# Altium schematic sheet PulseBeeper.SchDoc
size A3
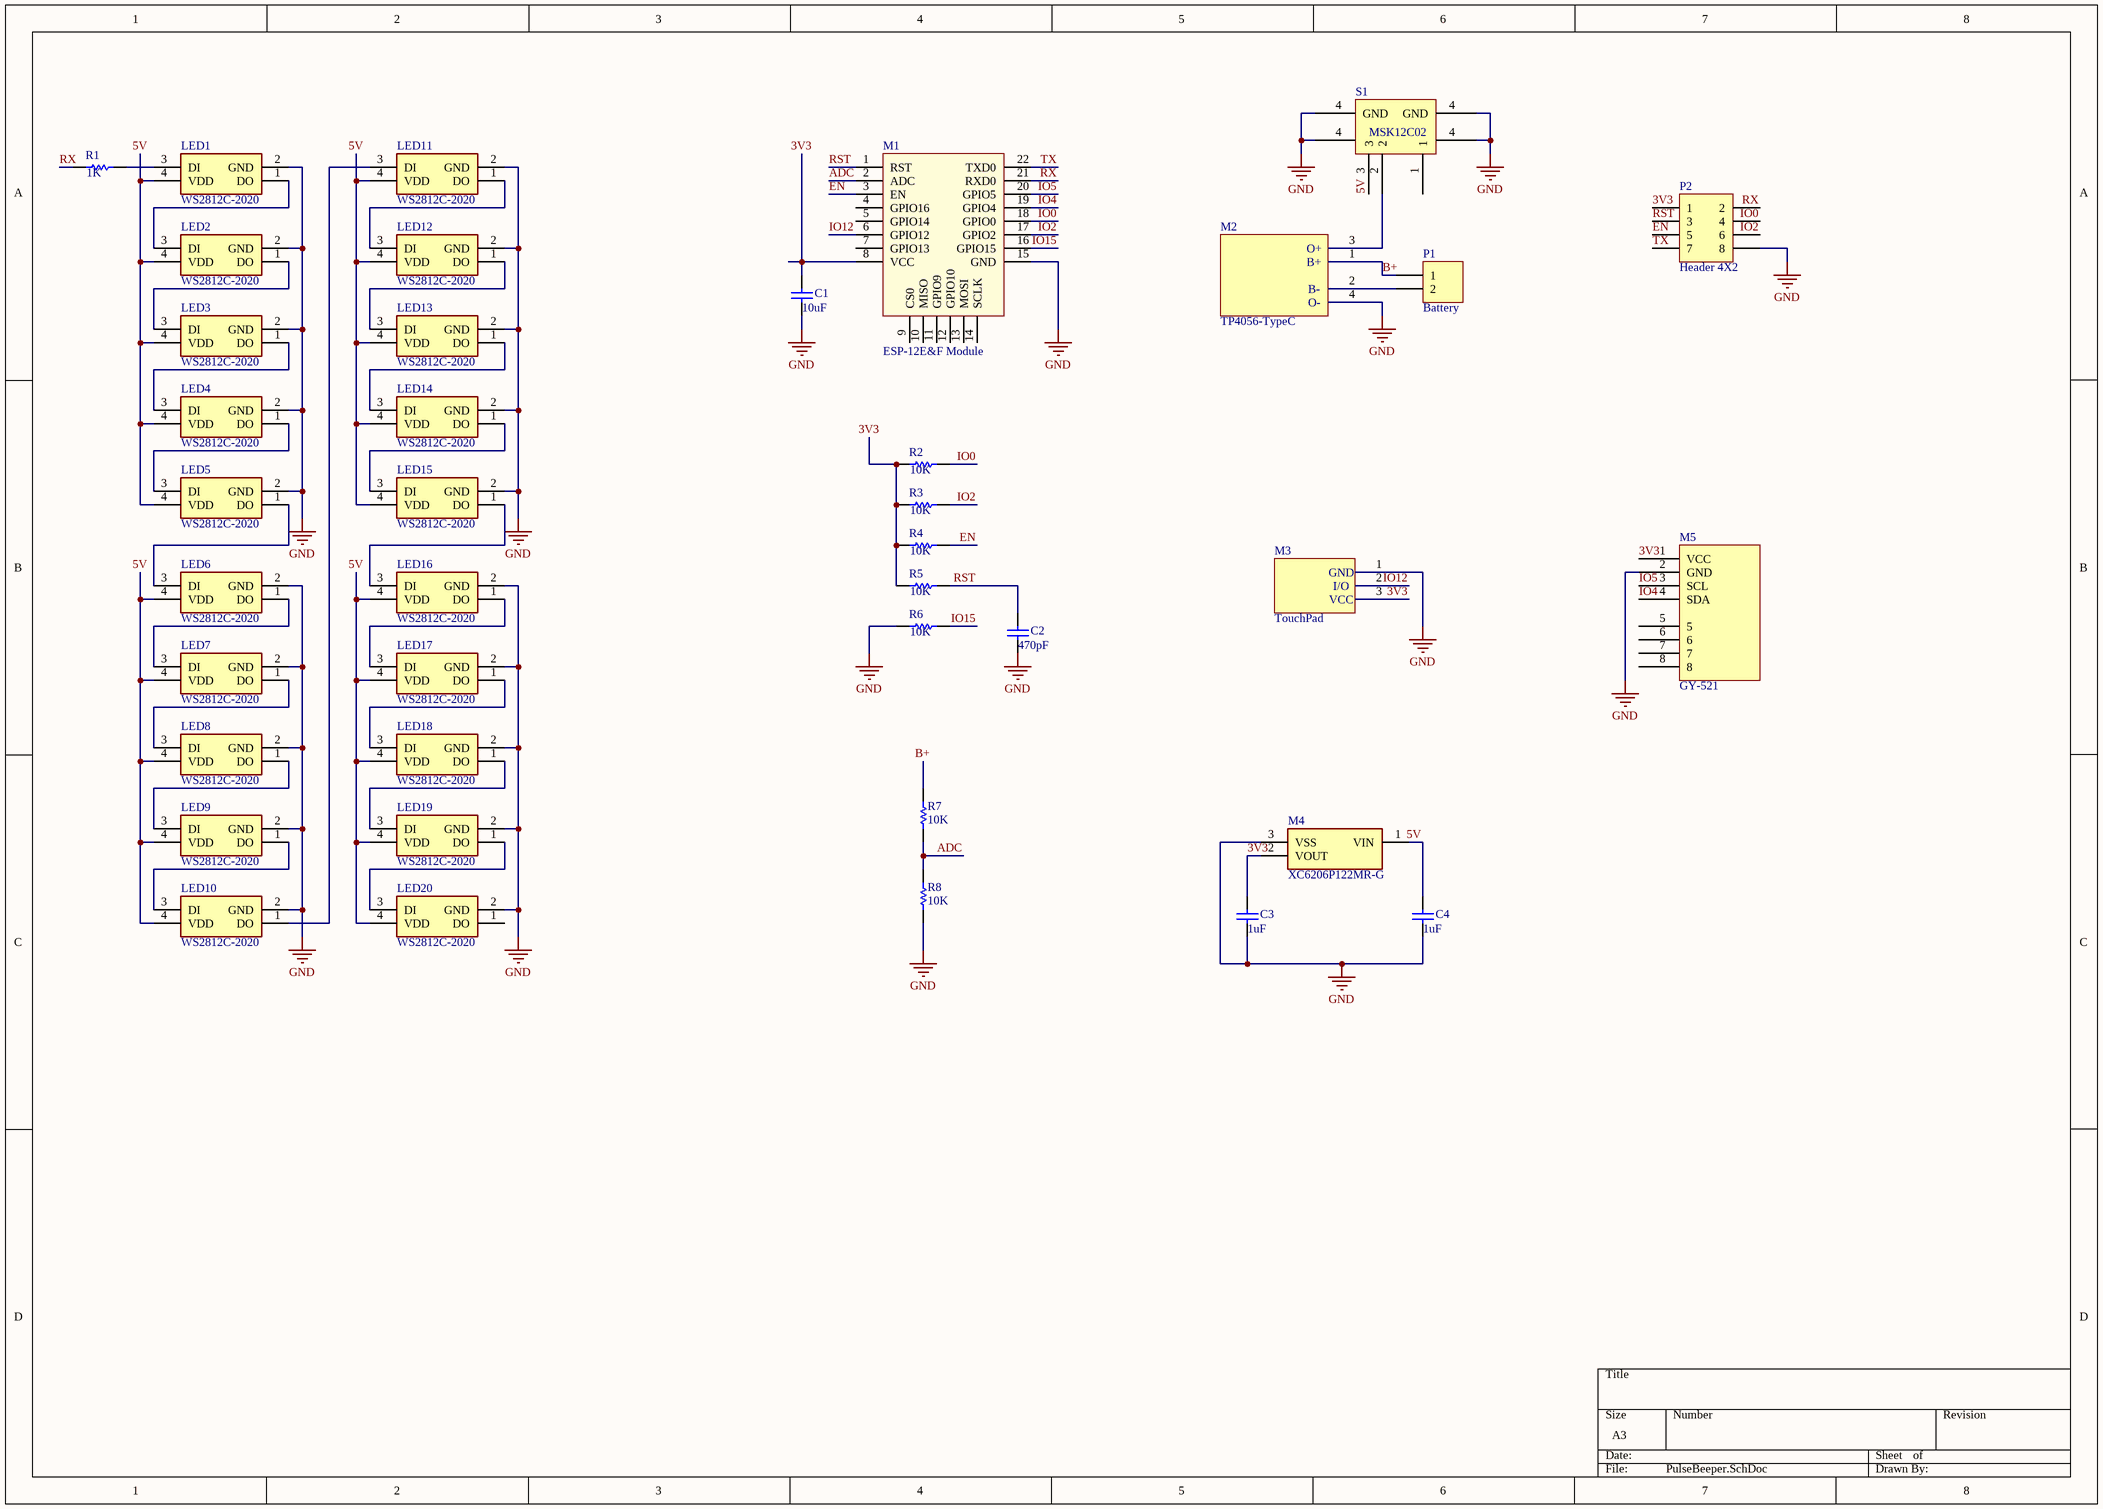
[diagram p0: PulseBeeper.SchDoc]

## Parts
C1  value 10uF  [6-0805_N]  (hidden comment: Cap)
C2  value 470pF  [6-0805_N]  (hidden comment: Cap)
C3  value 1uF  [6-0805_N]  (hidden comment: Cap)
C4  value 1uF  [6-0805_N]  (hidden comment: Cap)
LED1  WS2812C-2020  [WS2812 3535]
LED2  WS2812C-2020  [WS2812 3535]
LED3  WS2812C-2020  [WS2812 3535]
LED4  WS2812C-2020  [WS2812 3535]
LED5  WS2812C-2020  [WS2812 3535]
LED6  WS2812C-2020  [WS2812 3535]
LED7  WS2812C-2020  [WS2812 3535]
LED8  WS2812C-2020  [WS2812 3535]
LED9  WS2812C-2020  [WS2812 3535]
LED10  WS2812C-2020  [WS2812 3535]
LED11  WS2812C-2020  [WS2812 3535]
LED12  WS2812C-2020  [WS2812 3535]
LED13  WS2812C-2020  [WS2812 3535]
LED14  WS2812C-2020  [WS2812 3535]
LED15  WS2812C-2020  [WS2812 3535]
LED16  WS2812C-2020  [WS2812 3535]
LED17  WS2812C-2020  [WS2812 3535]
LED18  WS2812C-2020  [WS2812 3535]
LED19  WS2812C-2020  [WS2812 3535]
LED20  WS2812C-2020  [WS2812 3535]
M1  ESP-12E&F Module  [ESP-12E&F Module]
M2  TP4056-TypeC  [TP4056_17X26]
M3  TouchPad  [TouchPad]
M4  XC6206P122MR-G  [SOT23_N]
M5  GY-521  [GY-521]
P1  Battery  [BatteryPad]
P2  Header 4X2  [HDR2X4]
R1  value 1K  [6-0805_N]  (hidden comment: Res1)
R2  value 10K  [6-0805_N]  (hidden comment: Res1)
R3  value 10K  [6-0805_N]  (hidden comment: Res1)
R4  value 10K  [6-0805_N]  (hidden comment: Res1)
R5  value 10K  [6-0805_N]  (hidden comment: Res1)
R6  value 10K  [6-0805_N]  (hidden comment: Res1)
R7  value 10K  [6-0805_N]  (hidden comment: Res1)
R8  value 10K  [6-0805_N]  (hidden comment: Res1)
S1  MSK12C02  [MSK12C02]

## Nets
GND: C1.1 C2.1 C3.1 C4.1 LED1.2(GND) LED2.2(GND) LED3.2(GND) LED4.2(GND) LED5.2(GND) LED6.2(GND) LED7.2(GND) LED8.2(GND) LED9.2(GND) LED10.2(GND) LED11.2(GND) LED12.2(GND) LED13.2(GND) LED14.2(GND) LED15.2(GND) LED16.2(GND) LED17.2(GND) LED18.2(GND) LED19.2(GND) LED20.2(GND) M1.15(GND) M2.4 M3.1 M4.3(VSS) M5.2(GND) P2.8 R6.1 R8.1 S1.4(GND)
3V3: C1.2 C3.2 M1.8(VCC) M3.3 M4.2(VOUT) M5.1(VCC) P2.1 R2.1 R3.1 R4.1 R5.1
5V: C4.2 LED1.4(VDD) LED2.4(VDD) LED3.4(VDD) LED4.4(VDD) LED5.4(VDD) LED6.4(VDD) LED7.4(VDD) LED8.4(VDD) LED9.4(VDD) LED10.4(VDD) LED11.4(VDD) LED12.4(VDD) LED13.4(VDD) LED14.4(VDD) LED15.4(VDD) LED16.4(VDD) LED17.4(VDD) LED18.4(VDD) LED19.4(VDD) LED20.4(VDD) M4.1(VIN) S1.3
ADC: M1.2(ADC) R7.1 R8.2
B+: M2.1 P1.1 R7.2
EN: M1.3(EN) P2.5 R4.2
IO0: M1.18(GPIO0) P2.4 R2.2
IO2: M1.17(GPIO2) P2.6 R3.2
IO4: M1.19(GPIO4) M5.4(SDA)
IO5: M1.20(GPIO5) M5.3(SCL)
IO12: M1.6(GPIO12) M3.2
IO15: M1.16(GPIO15) R6.2
RST: C2.2 M1.1(RST) P2.3 R5.2
RX: M1.21(RXD0) P2.2 R1.1
TX: M1.22(TXD0) P2.7
NetLED1_1: LED1.1(DO) LED2.3(DI)
NetLED1_3: LED1.3(DI) R1.2
NetLED2_1: LED2.1(DO) LED3.3(DI)
NetLED3_1: LED3.1(DO) LED4.3(DI)
NetLED4_1: LED4.1(DO) LED5.3(DI)
NetLED5_1: LED5.1(DO) LED6.3(DI)
NetLED6_1: LED6.1(DO) LED7.3(DI)
NetLED7_1: LED7.1(DO) LED8.3(DI)
NetLED8_1: LED8.1(DO) LED9.3(DI)
NetLED9_1: LED9.1(DO) LED10.3(DI)
NetLED10_1: LED10.1(DO) LED11.3(DI)
NetLED11_1: LED11.1(DO) LED12.3(DI)
NetLED12_1: LED12.1(DO) LED13.3(DI)
NetLED13_1: LED13.1(DO) LED14.3(DI)
NetLED14_1: LED14.1(DO) LED15.3(DI)
NetLED15_1: LED15.1(DO) LED16.3(DI)
NetLED16_1: LED16.1(DO) LED17.3(DI)
NetLED17_1: LED17.1(DO) LED18.3(DI)
NetLED18_1: LED18.1(DO) LED19.3(DI)
NetLED19_1: LED19.1(DO) LED20.3(DI)
NetM2_2: M2.2 P1.2
NetM2_3: M2.3 S1.2

Not connected (* = marked no-connect by the designer): LED20 1(DO); M1 4(GPIO16) 5(GPIO14) 7(GPIO13) 9(CS0) 10(MISO) 11(GPIO9) 12(GPIO10) 13(MOSI) 14(SCLK); M5 5 6 7 8; S1 1

## Notes on the sheet
- (in symbol TouchPad) GND; I/O; VCC
- (in symbol TP4056-TypeC) O+; B+; B-; O-

## Library data of the parts
C1-C4 = Cap: Capacitor; Published: 8-Jun-2000; LatestRevisionDate: 17-Jul-2002; LatestRevisionNote: Re-released for DXP Platform.; PackageReference: RAD-0.3; Publisher: Altium Limited; PackageDescription: Radial Cap, Thru-Hole; 2 Leads; 0.3 in Pin Spacing
LED1-LED20 = WS2812C-2020: LED; Manufacturer_Name: Worldsemi; Datasheet Link: http://www.world-semi.com/DownLoadFile/139; Height: 0.84mm; Manufacturer_Part_Number: WS2812C-2020
M4 = XC6206P122MR-G: Integrated Circuit; Manufacturer_Name: Torex; Datasheet Link: https://www.torexsemi.com/file/xc6206/XC6206.pdf; Height: 1.3mm; Manufacturer_Part_Number: XC6206P122MR-G; Mouser Part Number: 865-XC6206P122MR-G; Mouser Price/Stock: https://www.mouser.co.uk/ProductDetail/Torex-Semiconductor/XC6206P122MR-G?qs=AsjdqWjXhJ%2F35%2FU%2FZk2JYg%3D%3D
P1 = Header 2: Header, 2-Pin; LatestRevisionDate: 17-Jul-2002; LatestRevisionNote: Re-released for DXP Platform.; Publisher: Altium Limited
P2 = Header 4X2: Header, 4-Pin, Dual row; LatestRevisionDate: 17-Jul-2002; LatestRevisionNote: Re-released for DXP Platform.; Publisher: Altium Limited
R1-R8 = Res1: Resistor; Published: 8-Jun-2000; LatestRevisionDate: 17-Jul-2002; LatestRevisionNote: Re-released for DXP Platform.; PackageReference: AXIAL-0.3; Publisher: Altium Limited; PackageDescription: Axial Device, Thru-Hole; 2 Leads; 0.3 in Pin Spacing